# Altium schematic sheet eps_bb2.SchDoc
size A4
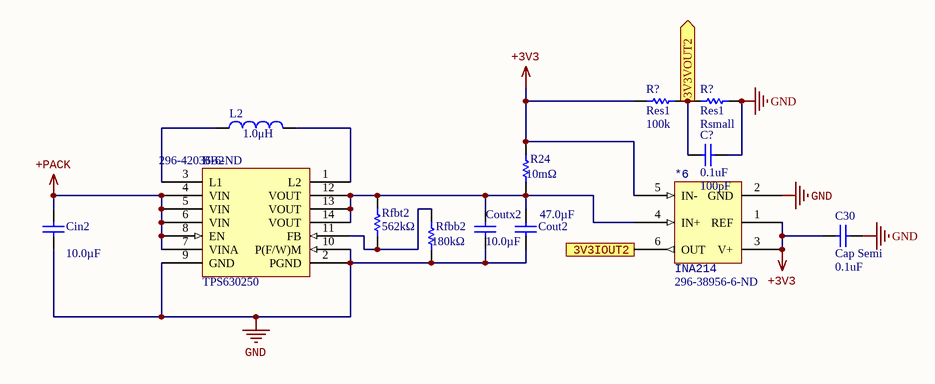
[diagram p0: eps_bb2.SchDoc]

## Parts
(Parts that share a designator on the sheet are numbered #1, #2 ... from top to bottom, then left to right.)
*6  INA214  Supplier Part Number 1: 296-38956-6-ND  [SOT65P210X110-6N]
BB2  TPS630250  Supplier Part Number 1: 296-42036-6-ND  [RNC0014A]
C30  Cap Semi  value 0.1uF  [1608[0603]]
C?  0.1uF  value 100pF  [RAD-0.3]
Cin2  value 10.0µF  [1608[0603]]  (hidden comment: Cap)
Cout2  value 47.0µF  [1608[0603]]  (hidden comment: Cap)
Coutx2  value 10.0µF  [1608[0603]]  (hidden comment: Cap)
L2  value 1.0μH  [1608[0603]]  (hidden comment: Inductor)
R24  value 10mΩ  [1608[0603]]  (hidden comment: Res1)
R?#1  Res1  value 100k  [AXIAL-0.3]
R?#2  Res1  value Rsmall  [AXIAL-0.3]
Rfbb2  value 180kΩ  [1608[0603]]  (hidden comment: Res1)
Rfbt2  value 562kΩ  [1608[0603]]  (hidden comment: Rfbt1)

## Ports
3V3IOUT2 (out), 3V3VOUT2 (out)

## Nets
+3V3: *6.1(REF) *6.3(V+) *6.5(IN-) C30.2 R24.2 R?#1.1
+PACK: BB2.4(VIN) BB2.5(VIN) BB2.6(VIN) BB2.7(VINA) BB2.8(EN) Cin2.2
GND: *6.2(GND) BB2.2(PGND) BB2.9(GND) BB2.10(P(F/W)M) C30.1 C?.2 Cin2.1 Cout2.1 Coutx2.1 R?#2.2 Rfbb2.1
3V3IOUT2: *6.6(OUT) ; port 3V3IOUT2
3V3VOUT2: C?.1 R?#1.2 R?#2.1 ; port 3V3VOUT2
Net*6_4: *6.4(IN+) BB2.12(VOUT) BB2.13(VOUT) BB2.14(VOUT) Cout2.2 Coutx2.2 R24.1 Rfbt2.1
NetBB2_1: BB2.1(L2) L2.2
NetBB2_3: BB2.3(L1) L2.1
NetBB2_11: BB2.11(FB) Rfbb2.2 Rfbt2.2

## Library data of the parts
*6 = INA214: Current monitor; Supplier 1: Digi-Key
BB2 = TPS630250: Buck-boost converter; Supplier 1: Digi-Key
C30 = Cap Semi: Capacitor (Semiconductor SIM Model); Published: 8-Jun-2000; LatestRevisionDate: 29-May-2009; LatestRevisionNote: IPC-7351 Footprint Added.; PackageReference: C1206; Publisher: Altium Limited; PackageDescription: Chip Capacitor
C? Cin2 Cout2 Coutx2 = Cap: Capacitor; Published: 8-Jun-2000; LatestRevisionDate: 17-Jul-2002; LatestRevisionNote: Re-released for DXP Platform.; PackageReference: RAD-0.3; Publisher: Altium Limited; PackageDescription: Radial Cap, Thru-Hole; 2 Leads; 0.3 in Pin Spacing
L2 = Inductor: Code_IEC: 1005; Published: 8-Jun-2000; LatestRevisionDate: 29-May-2009; LatestRevisionNote: IPC-7351 Footprint Added.; PackageReference: 0402-A; Publisher: Altium Limited; PackageDescription: Chip Inductor; Code_JEITA: 0402
R24 R?#1 R?#2 Rfbb2 Rfbt2 = Res1: Resistor; Published: 8-Jun-2000; LatestRevisionDate: 17-Jul-2002; LatestRevisionNote: Re-released for DXP Platform.; PackageReference: AXIAL-0.3; Publisher: Altium Limited; PackageDescription: Axial Device, Thru-Hole; 2 Leads; 0.3 in Pin Spacing